# Altium schematic sheet pH_sensor.SchDoc
size A4; SheetNumber: 7; SheetTotal: 7
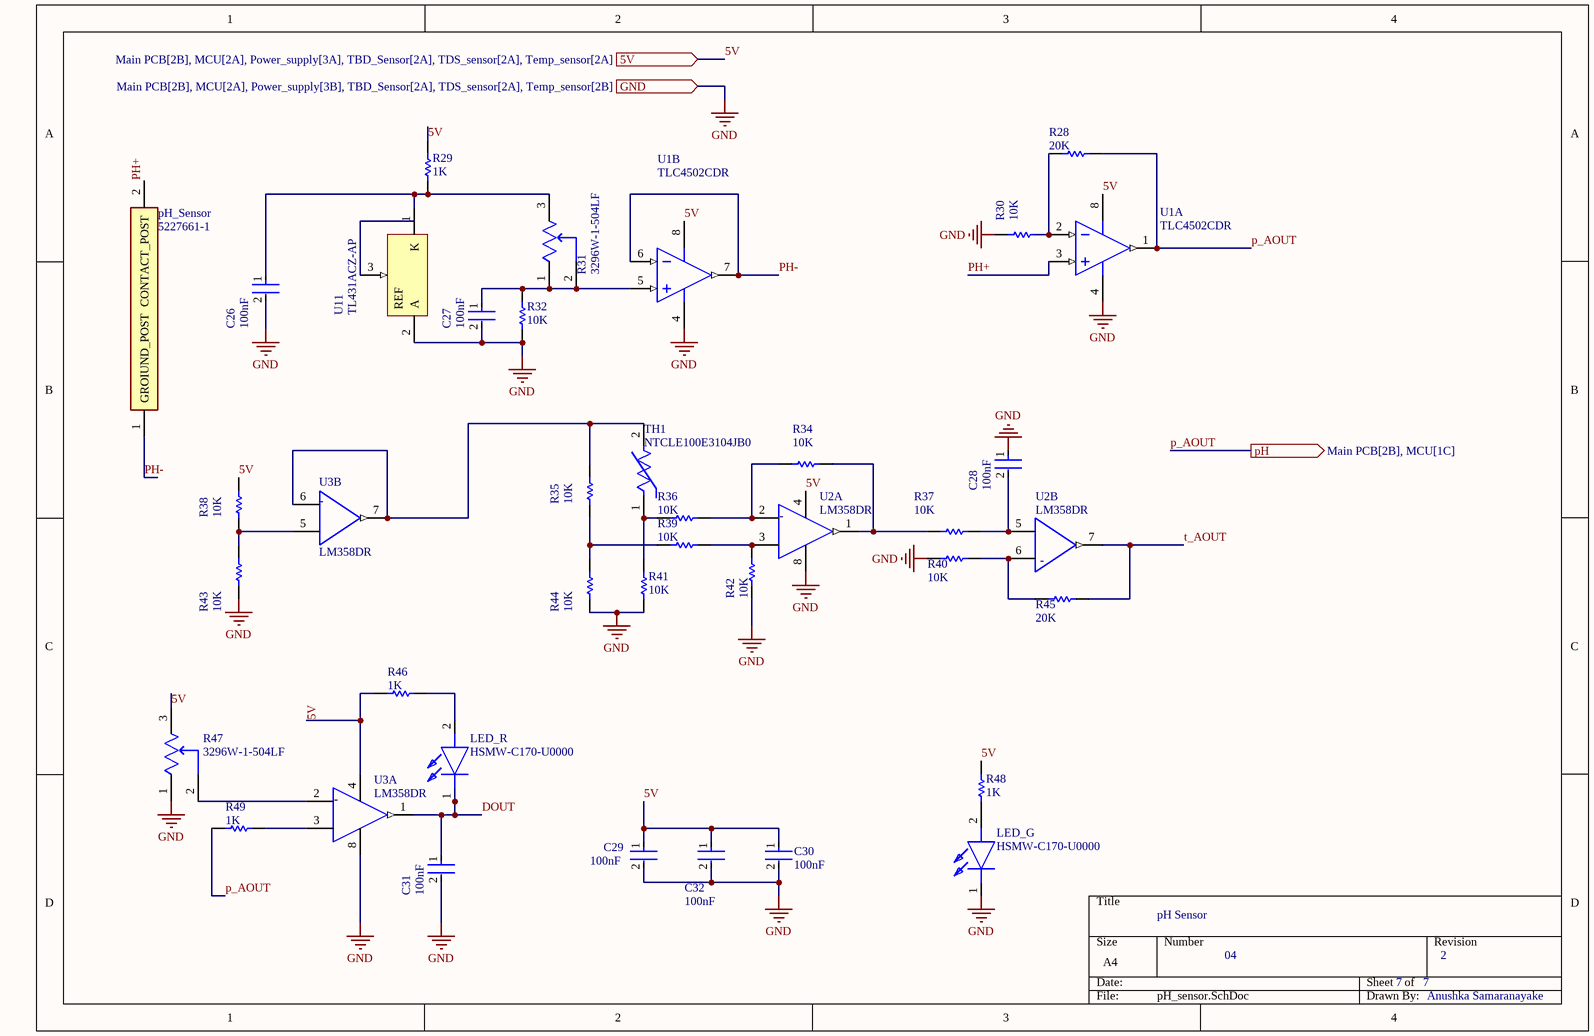
[diagram p0: pH_sensor.SchDoc]

## Parts
C26  100nF  [FP-CL31-IPC_B]
C27  100nF  [FP-CL31-IPC_B]
C28  100nF  [FP-CL31-IPC_B]
C29  100nF  [FP-CL31-IPC_B]
C30  100nF  [FP-CL31-IPC_B]
C31  100nF  [FP-CL31-IPC_B]
C32  100nF  [FP-CL31-IPC_B]
LED_G  HSMW-C170-U0000  [LEDC2012X90N]
LED_R  HSMW-C170-U0000  [LEDC2012X90N]
pH_Sensor  5227661-1  [5227161-1]
R28  20K  [RESC3216X70X50LL20T25]
R29  1K  [RESC3216X70X50ML20T25]
R30  10K  [RESC3216X70X50LL20T25]
R31  3296W-1-504LF  [FP-3296W-MFG]
R32  10K  [RESC3216X70X50LL20T25]
R34  10K  [RESC3216X70X50LL20T25]
R35  10K  [RESC3216X70X50LL20T25]
R36  10K  [RESC3216X70X50LL20T25]
R37  10K  [RESC3216X70X50LL20T25]
R38  10K  [RESC3216X70X50LL20T25]
R39  10K  [RESC3216X70X50LL20T25]
R40  10K  [RESC3216X70X50LL20T25]
R41  10K  [RESC3216X70X50LL20T25]
R42  10K  [RESC3216X70X50LL20T25]
R43  10K  [RESC3216X70X50LL20T25]
R44  10K  [RESC3216X70X50LL20T25]
R45  20K  [RESC3216X70X50LL20T25]
R46  1K  [RESC3216X70X50ML20T25]
R47  3296W-1-504LF  [FP-3296W-MFG]
R48  1K  [RESC3216X70X50ML20T25]
R49  1K  [RESC3216X70X50ML20T25]
TH1  NTCLE100E3104JB0  [FP-NTCLE100E3104JB0-MFG]
U1  TLC4502CDR  [D0008A_M]  (parts A,B of 2)
U2  LM358DR  [FP-D0008A-MFG]  (parts A,B of 2)
U3  LM358DR  [FP-D0008A-MFG]  (parts A,B of 2)
U11  TL431ACZ-AP  [TO-92]

## Ports
5V (in, see Main PCB[2B], MCU[2A], Power_supply[3A], TBD_Sensor[2A], TDS_sensor[2A], Temp_sensor[2A]), GND (in, see Main PCB[2B], MCU[2A], Power_supply[3B], TBD_Sensor[2A], TDS_sensor[2A], Temp_sensor[2B]), pH (out, see Main PCB[2B], MCU[1C])

## Nets
GND: C26.2 C27.2 C28.1 C29.2 C30.2 C31.2 C32.2 LED_G.1(K) R30.1 R32.1 R40.1 R41.1 R42.1 R43.1 R44.1 R47.1(CCW) U1.4(VDD-/GND) U2.8(V+) U3.8(V+) U11.2(A) ; port GND
5V: C29.1 C30.1 C32.1 R29.1 R38.2 R46.1 R47.3(CW) R48.1 U1.8(VDD+) U2.4(V-) U3.4(V-) ; port 5V
DOUT: C31.1 LED_R.1(K) U3.1(1OUT)
p_AOUT: R28.2 R49.1 U1.1(OUT1) ; port pH
PH+: pH_Sensor.2(CONTACT_POST) U1.3(IN1+)
PH-: pH_Sensor.1(GROIUND_POST) U1.6(IN2-) U1.7(OUT2)
t_AOUT: R45.2 U2.7(2OUT)
NetC26_1: C26.1 R29.2 R31.3(CW) U11.1(K)
NetC27_1: C27.1 R31.1(CCW) R31.2(WIPER) R32.2 U1.5(IN2+)
NetC28_2: C28.2 R37.2 U2.5(IN2+)
NetLED_G_2: LED_G.2(A) R48.2
NetLED_R_2: LED_R.2(A) R46.2
NetR28_1: R28.1 R30.2 U1.2(IN1-)
NetR34_1: R34.1 R36.2 U2.2(IN1-)
NetR34_2: R34.2 R37.1 U2.1(1OUT)
NetR35_1: R35.1 R39.1 R44.2
NetR35_2: R35.2 TH1.2 U3.6(IN2-) U3.7(2OUT)
NetR36_1: R36.1 R41.2 TH1.1
NetR38_1: R38.1 R43.2 U3.5(IN2+)
NetR39_2: R39.2 R42.2 U2.3(IN1+)
NetR40_2: R40.2 R45.1 U2.6(IN2-)
NetR47_2: R47.2(WIPER) U3.2(IN1-)
NetR49_2: R49.2 U3.3(IN1+)

Not connected (* = marked no-connect by the designer): U11 3(REF)

## Notes on the sheet
- pH Sensor
- 04
- 7
- 2
- Anushka Samaranayake
- (in symbol CMP-1685-00009-2, part A) -
- (in symbol CMP-1685-00009-2, part B) -

## Library data of the parts
C26-C32 = CMP-13271-001731-1: Cap Ceramic 100nF 50V X7R ±10% SMD 1206 +125°C Embossed T/R; Voltage: 50V; Thickness: 0.037inch; Lead Free: Lead Free; Length: 3.2mm; Min Operating Temperature: -55°C; Package Quantity: 15000; Packaging: Tape and Reel; Mount: Surface Mount; Depth: 1.6mm; Case/Package: 1206; Voltage Rating (DC): 50V; Tolerance: 10%; Height: 0.85mm; Capacitance: 100nF; Radiation Hardening: No; Dielectric: X7R; Voltage Rating: 50V; Max Operating Temperature: 125°C; Width: 0.063inch
LED_G LED_R = HSMW-C170-U0000: LED; Manufacturer_Name: Avago Technologies; Datasheet Link: https://componentsearchengine.com/Datasheets/2/HSMW-C170-U0000.pdf; Height: 0.9mm; Manufacturer_Part_Number: HSMW-C170-U0000; Mouser Part Number: 630-HSMW-C170-U0000; Mouser Price/Stock: https://www.mouser.co.uk/ProductDetail/Broadcom-Avago/HSMW-C170-U0000?qs=tMOYG%252Bw4%252BLwGyeHODzQdug%3D%3D
pH_Sensor = 5227661-1: Connector; Manufacturer_Name: TE Connectivity; Datasheet Link: https://www.te.com/commerce/DocumentDelivery/DDEController?Action=srchrtrv&DocNm=1307191_BNC_Connectors&DocType=Catalog%20Section&DocLang=English&PartCntxt=5227661-1&DocFormat=pdf; Manufacturer_Part_Number: 5227661-1; Mouser Part Number: 571-5227661-1; Mouser Price/Stock: https://www.mouser.co.uk/ProductDetail/TE-Connectivity/5227661-1?qs=GSeC4G%252BEqEUTcTZ6HpL7ew%3D%3D; Arrow Part Number: 5227661-1; Arrow Price/Stock: https://www.arrow.com/en/products/5227661-1/te-connectivity?region=nac
R28 R30 R32 R34-R45 = CMP-2003-04407-1: Manufacturer: Panasonic; Part Number: ERA8AEB103V
R29 R46 R48 R49 = CMP-2003-04406-1: Part Number: ERA8AEB102V; Manufacturer: Panasonic
R31 R47 = CMP-2000-05583-2: TRIMMER 500K OHM 0.5W PC PIN TOP; Manufacturer: Bourns; Resistance: 500kΩ; Temperature Coefficient: 100ppm/°C; Value: 500kΩ; Tolerance: 10%; Voltage Rating: 300V; Standoff Height: 0.38mm; ComponentLink2Description: Datasheet; Package: 3296W; Series: Trimpot 3296-Sealed; Lead Free: Yes; Octopart: https://octopart.com/3296w-1-504lf-bourns-143884; Device Class L2: Resistors; Automotive: No; RoHS: TRUE; Temperature Range High: +125°C; Manufacturer Part Number: 3296W-1-504LF; Height: 12.05mm; Power Rating: 0.5W; Temperature Range Low: -55°C; ComponentLink2URL: https://www.bourns.com/docs/Product-Datasheets/3296.pdf; Device Class L1: Passive Components; Device Class L3: Variable Resistors and Potentiometers; Category: Res; Temperature: -55°C to +125°C; Digikey Description: TRIMMER 500K OHM 0.5W PC PIN TOP; Mouser Description: Trimmer; Cermet; Rest 500 Kilohms; PCB; 25 Turns; Pwr-Rtg 0.5W
TH1 = CMP-02404-000021-1: NTC THERMISTOR 100K OHM 5% BEAD; Lead Diameter: 0.6mm; Accuracy: 1.5%; Max Power Dissipation: 500mW; Lead Length: 17mm; Resistance: 100kR; Package Quantity: 500; Resistance Tolerance: 5%; Height: 9mm; Case/Package: Radial; Depth: 3mm; Lead Free: Lead Free; Tolerance: 5%; Number of Pins: 2; RoHS Compliant: Yes; Lead Pitch: 2.54mm; Min Operating Temperature: -40°C; Termination: Radial; Series: 2322; Length: 3.3mm; Radiation Hardening: No; Mount: Through Hole; Max Operating Temperature: 125°C; Packaging: Bulk
U1 = CMP-0271-00178-3: Advanced LinEPIC Self-Calibrating Precision Dual Operational Amplifier, 4 to 6 V, 0 to 70 degC, 8-pin SOIC (D8), Green (RoHS & no Sb/Br); Manufacturer: Texas Instruments; Total Supply Voltage(Min)(+5V is 5, +/-5V is 10): 4; Slew Rate(Typ)(V/us): 2.5; Iq per channel(Max)(mA): 3.5; Vn at 1kHz(Typ)(nV/rtHz): 12; CMRR(Min)(dB): 90; Number of Channels: 2; Vio (25C)(Max)(mV): 0.1; Offset Drift(Typ)(uV/C): 1; IIB(Max)(pA): 60; Sub Family: Low Offset Voltage Amplifier (<=500uV), Precision Amplifier; Total Supply Voltage(Max)(+5V is 5, +/-5V is 10): 6; ComponentLink1Description: Manufacturer URL; DatasheetVersion: SLOS221B; PackageDescription: 8-Pin Plastic Small Outline, Body 4.9 x 3.9 mm, Pitch 1.27 mm; Eco-Plan: Green (RoHS & no Sb/Br); Code_JEDEC: MS-012; ComponentLink3URL: http://www.ti.com/litv/pdf/msoi002j; ComponentLink3Description: Package Specification; ComponentLink1URL: http://www.ti.com/; PackageVersion: 4040047-3/M, 06/2011; PartNumber: TLC4502CDR; ComponentLink2Description: Datasheet; PackageReference: D0008A; ComponentLink2URL: http://www.ti.com/general/docs/lit/getliterature.tsp?genericPartNumber=TLC4502&fileType=pdf; Mounting Technology: Surface Mount
U2 U3 = CMP-1685-00009-2: IC OPAMP GP 2 CIRCUIT 8SOIC; Output Current: 30mA; Min Dual Supply Voltage: 1.5V; Input Offset Voltage (Vos): 7mV; Power Supply Rejection Ratio (PSRR): 65dB; Unity Gain Bandwidth Product: 700kHz; Number of Channels: 2; Min Supply Voltage: 3V; Max Dual Supply Voltage: 16V; Dual Supply Voltage: 9V; Max Supply Voltage: 32V; Nominal Supply Current: 1.2mA; Slew Rate: 0.3V/µs; Input Bias Current: 250nA; Voltage Gain: 100dB; Operating Supply Current: 1mA; REACH SVHC: No SVHC; Package Quantity: 2500; Width: 3.91mm; Max Operating Temperature: 70°C; Min Operating Temperature: 0°C; Mount: Surface Mount; Length: 4.9mm; Radiation Hardening: No; Case/Package: SOIC; Lead Free: Lead Free; Number of Elements: 2; Packaging: Tape and Reel; Output Current per Channel: 30mA; Number of Circuits: 2; Bandwidth: 700kHz; Operating Supply Voltage: 16V; Gain Bandwidth Product: 700kHz; Number of Pins: 8; Number of Amplifiers: 2; Height: 1.58mm; Common Mode Rejection Ratio: 65dB; Contact Plating: Gold
U11 = CMP-0242-00005-1: Programmable Voltage Reference, 2.5 to 36V, 3-Pin TO-92, Ammopak; ComponentLink2URL: http://www.st.com/internet/com/TECHNICAL_RESOURCES/TECHNICAL_LITERATURE/DATASHEET/CD00000986.pdf; PackageDescription: TO, Flat Index; 3 In-Line, Axial Leads; Body Dia. 4.7mm; Lead Dia. 0.56 mm (max); DatasheetVersion: Oct-2011; ComponentLink1URL: http://www.st.com; ComponentLink1Description: Manufacturer URL; PackageVersion: 2011; ComponentLink2Description: Datasheet; PackageReference: TO-92